# EasyEDA Pro project little_squeaky_machine.eprj, board Little Squeaky Machine
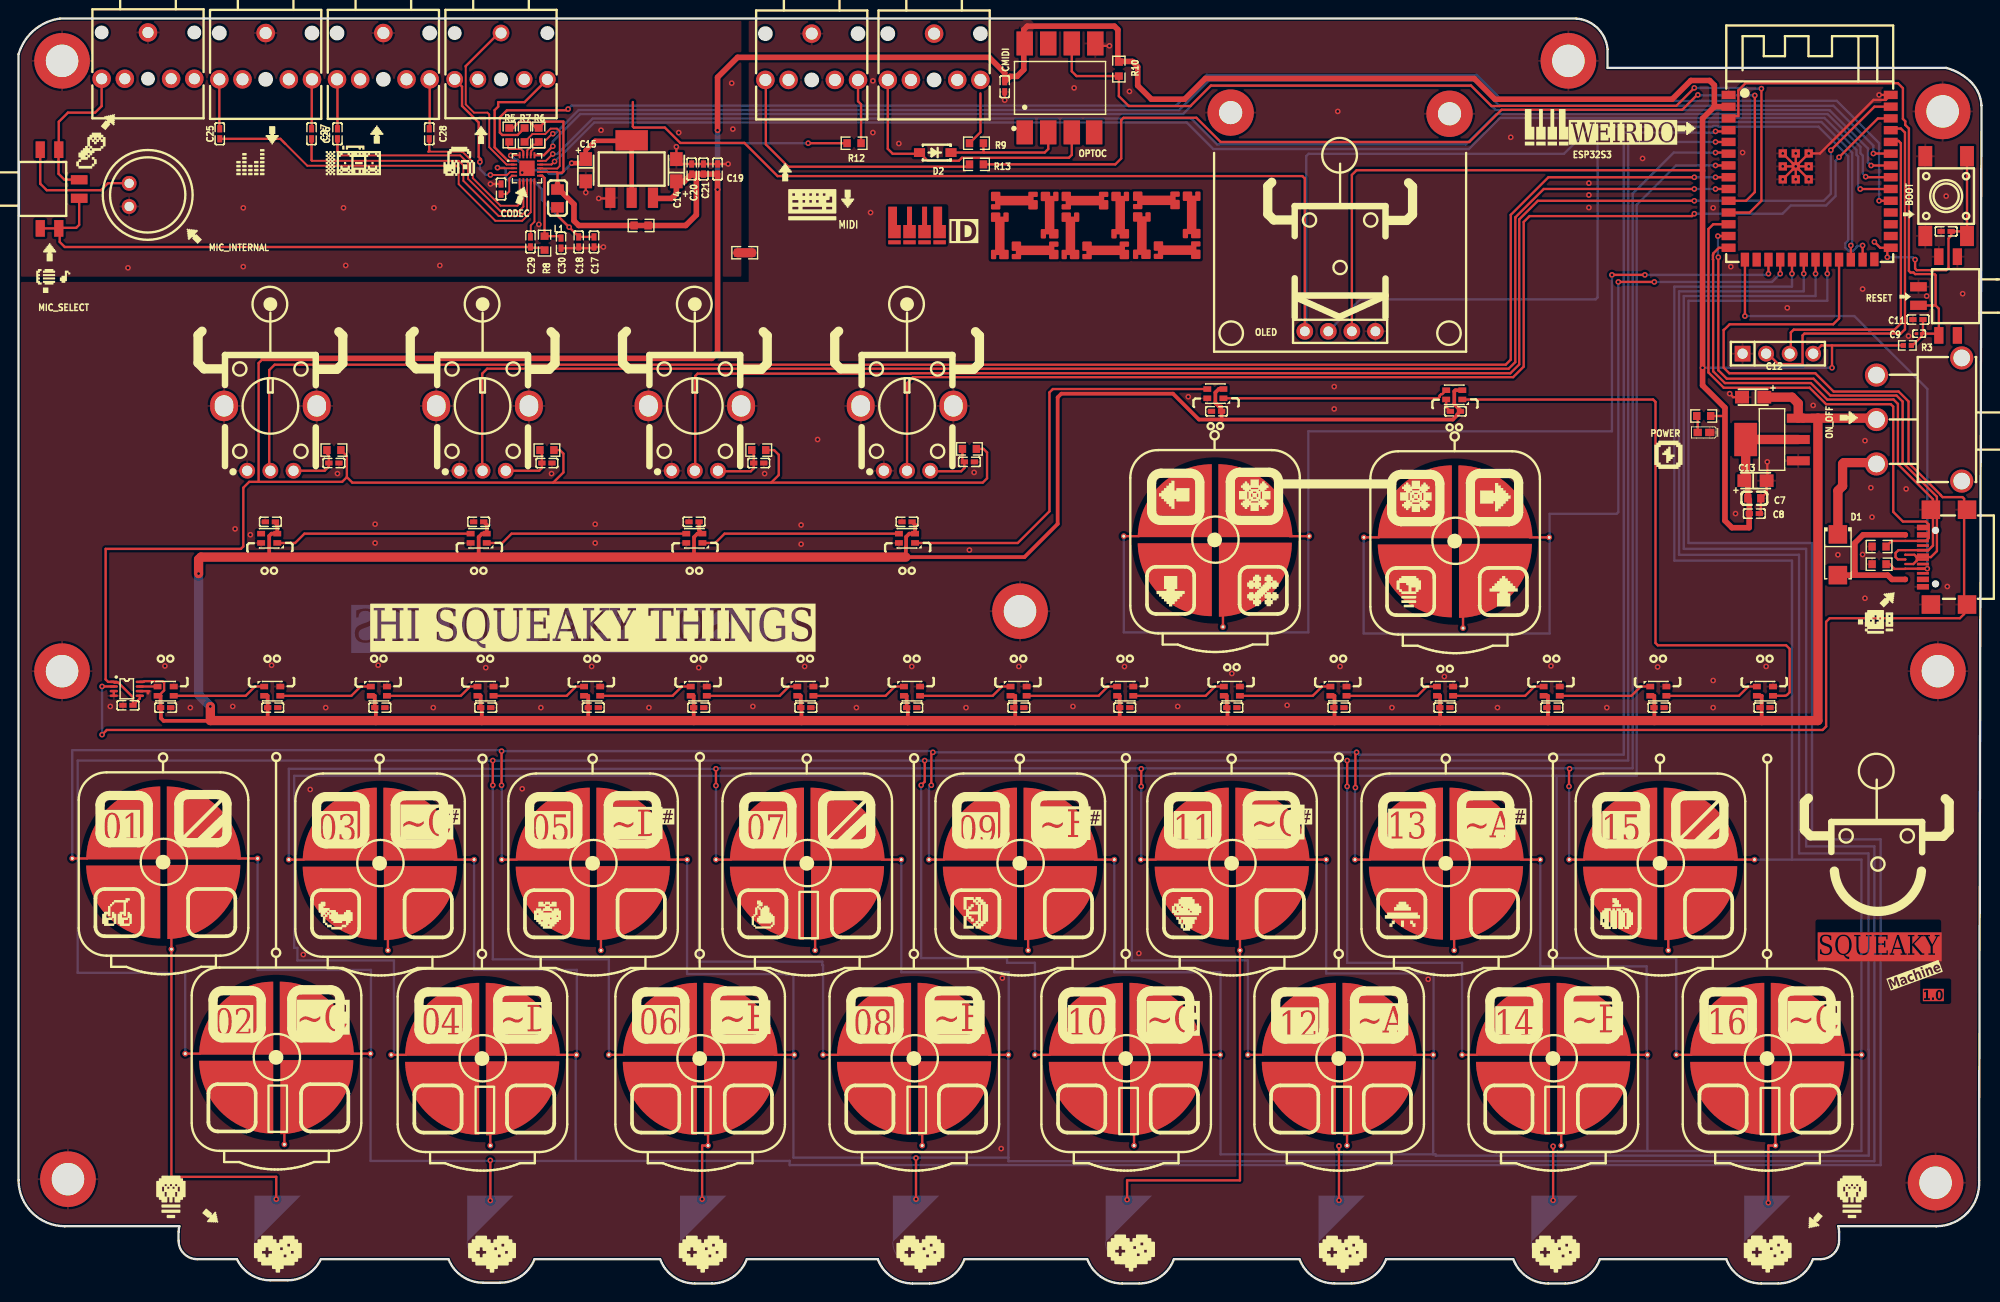
[diagram p4: board, top side]
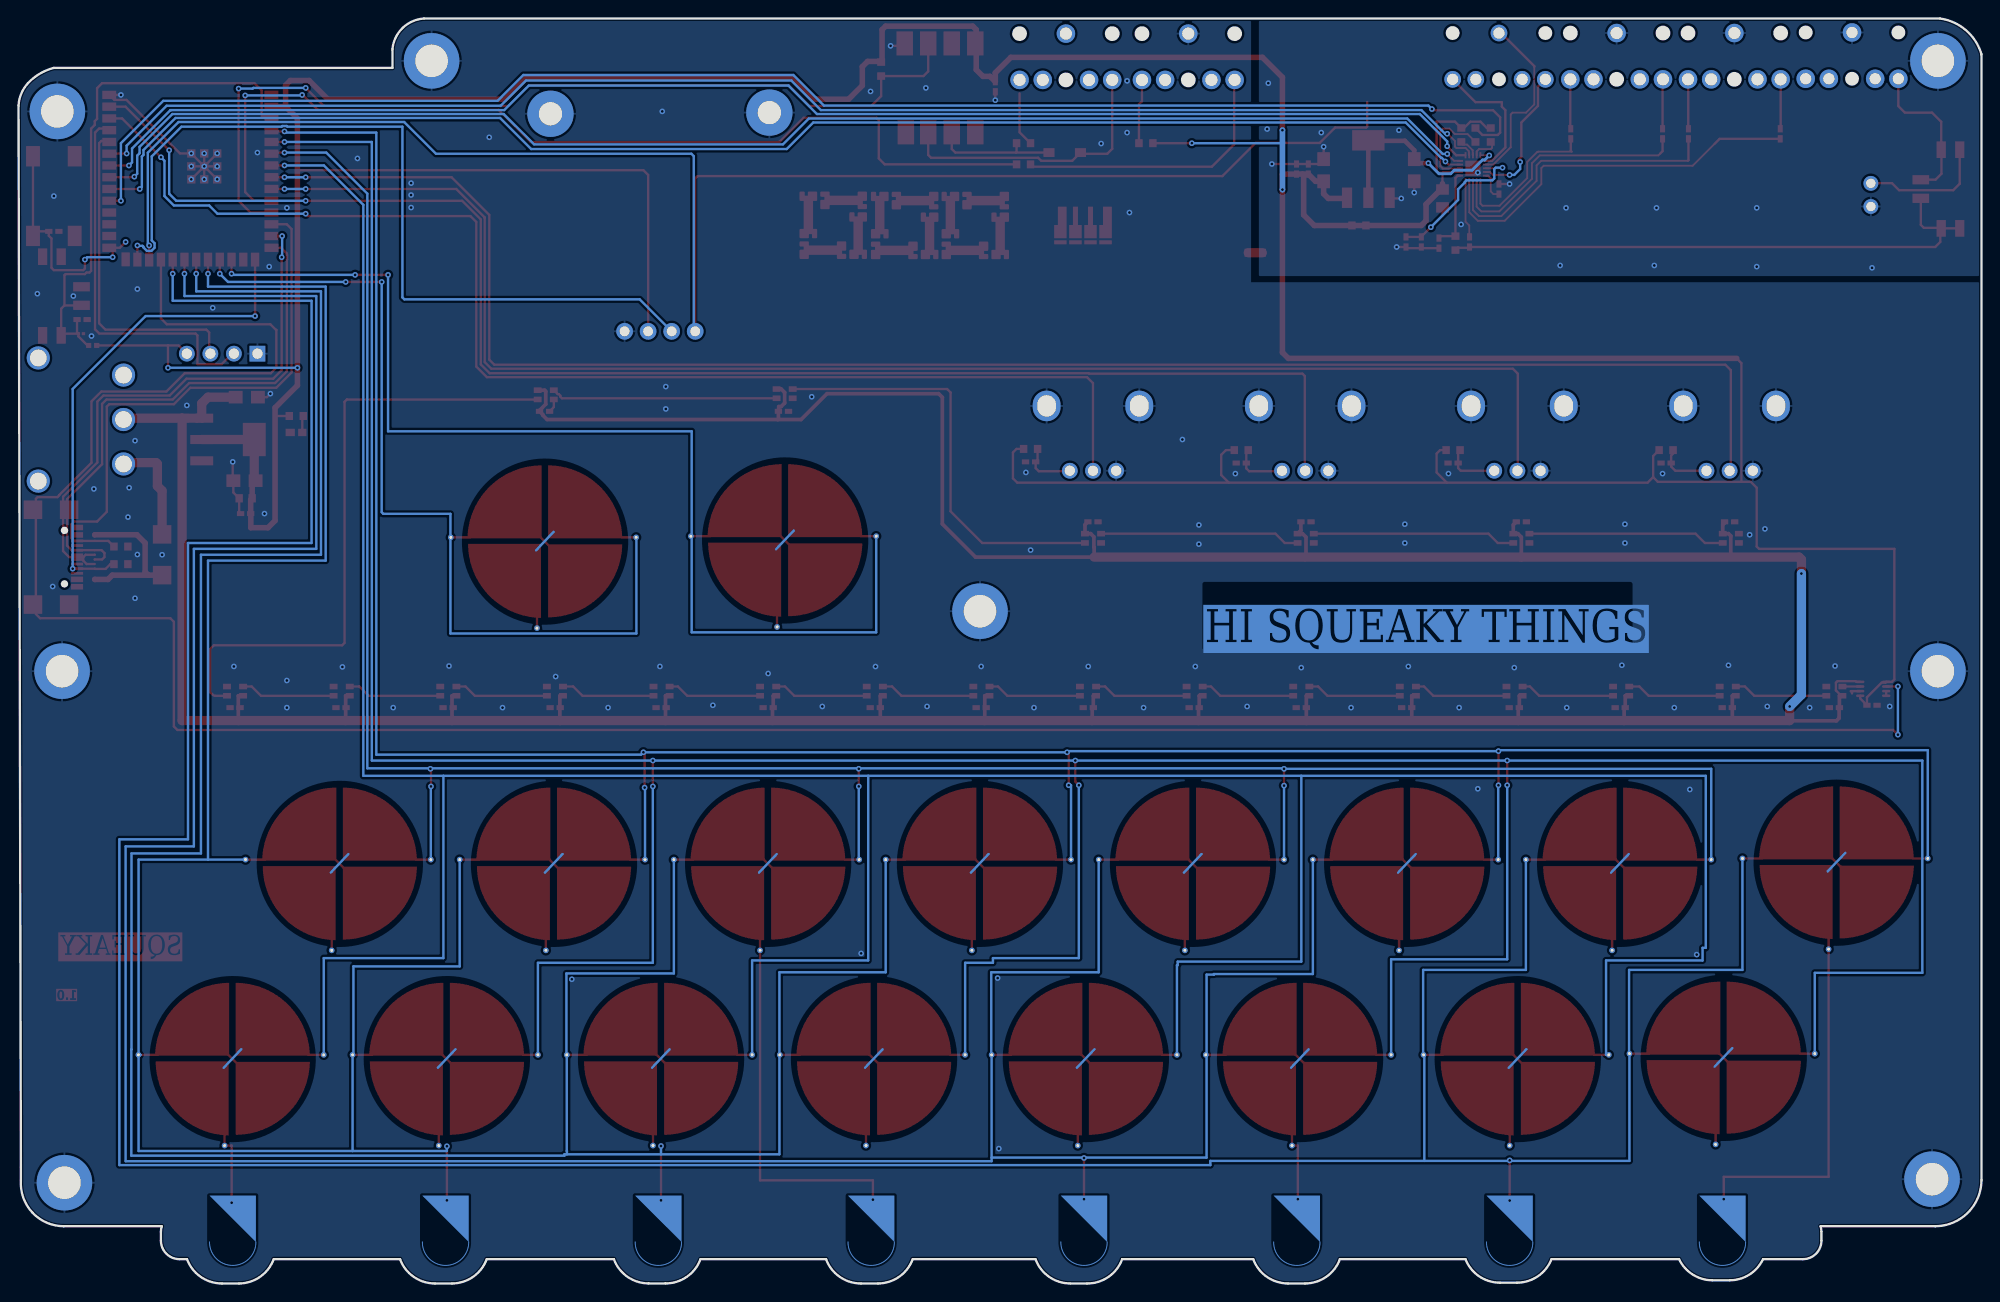
[diagram p5: board, bottom side, seen from below]

Outline 211.84 x 136.61 mm; copper layers: Top Layer, Bottom Layer. Coordinates in mm from the lower left corner of the outline.
Outline path: 0,132.74 arc(1.67,135.34) 4.48,136.61 168.08,136.61 arc(170.39,135.58) 171.48,133.3 171.48,131.28 208.04,131.28 arc(209.54,130.65) 210.82,129.63 arc(211.54,128.51) 211.84,127.21 211.58,12.56 211.58,11.14 arc(211.32,9.27) 210.34,7.66 arc(208.81,6.57) 206.96,6.18 196.38,6.18 arc(196.45,5.89) 196.47,5.58 196.47,4.63 arc(195.88,3.21) 194.47,2.63 193.65,2.63 arc(192.19,0.72) 189.89,0 188.06,0 arc(185.77,0.72) 184.3,2.63 170.66,2.63 arc(169.2,0.72) 166.91,0 165.07,0 arc(162.78,0.72) 161.31,2.63 147.59,2.63 arc(146.12,0.73) 143.83,0.01 142,0.01 arc(139.71,0.73) 138.24,2.63 124.69,2.63 arc(123.22,0.72) 120.93,0 119.1,0 arc(116.81,0.72) 115.34,2.63 102.08,2.63 arc(100.62,0.72) 98.33,0 96.49,0 arc(94.2,0.72) 92.73,2.63 78.59,2.63 arc(77.12,0.72) 74.83,0 73,0 arc(70.7,0.72) 69.24,2.63 55.69,2.63 arc(54.22,0.78) 51.96,0.08 50.13,0.08 arc(47.87,0.78) 46.4,2.63 32.63,2.63 arc(31.16,0.96) 29.02,0.34 27.19,0.34 arc(25.05,0.96) 23.57,2.63 19.27,2.63 arc(17.86,3.21) 17.27,4.63 17.27,5.58 arc(17.3,5.89) 17.36,6.18 5,6.18 arc(1.46,7.65) 0,11.18 0,132.74
Stack: Top Layer 0.035mm / Dielectric1 1.51mm FR4 er 4.5 / Bottom Layer 0.035mm

## Design rules (mm)
template: Custom Config
spacing copperThickness1oz (default): track to track 0.17, other pairs 0.152 to 0.3
spacing copperThickness2oz: track to track 0.203, other pairs 0.152 to 0.3
track width copperThickness1oz (default): min 0.127, default 0.254, max 2.54
track width copperThickness2oz: min 0.203, default 0.254, max 2.54
differential pair differentialPair (default): width min 0.127, default 0.254, max 2.54; gap min 0.152, default 0.152
via viaSize (default): diameter min 0.5, default 0.61, max 10; hole min 0.3, default 0.305, max 6.3

## Placement (name value [footprint] x y rotation side)
3_3_BRIGDE  0  [R0603]  67.18 114.26 0 top
A_D_BRIDGE  0  [R0603]  78.37 111.32 0 top
BOOT  TS-1102S-C-C-B  [KEY-SMD_4P-L6.0-W6.0-P4.50-LS8.6]  208.03 117.44 270 top
C7  10uF  [C0603]  187.32 84.8 0 top
C8  100nF  [C0402]  187.32 83.15 180 top
C9  1uF  [C0201]  205.1 102.58 180 top
C10  100nF  [C0402]  208.03 113.63 0 top
C11  100nF  [C0402]  204.98 104.1 0 top
C12  10uF  [CASE-A_3216]  187.2 95.72 180 top
C13  22uF  [CASE-A_3216]  187.45 86.7 0 top
C14  10uF  [CASE-A_3216]  70.99 120.23 90 top
C15  22uF  [CASE-A_3216]  61.21 120.23 270 top
C16  100nF  [C0402]  11.81 62.44 0 top
C17  100nF  [C0402]  62.1 112.48 90 top
C18  2.2uF  [C0402]  60.45 112.48 90 top
C19  2.2uF  [C0402]  75.44 120.36 270 top
C20  100nF  [C0402]  72.64 120.36 270 top
C21  100nF  [C0402]  73.91 120.36 270 top
C22  150nF  [C0402]  52.07 118.2 270 top
C25  2.2uF  [C0402]  21.72 124.16 270 top
C26  2.2uF  [C0402]  31.62 124.16 270 top
C27  2.2uF  [C0402]  34.42 124.16 270 top
C28  2.2uF  [C0402]  44.32 124.16 270 top
C29  100nF  [C0402]  55.24 112.48 90 top
C30  2.2uF  [C0402]  58.55 112.36 90 top
C31  22uF  [C0402]  102.62 88.73 180 top
C32  22uF  [C0402]  79.88 88.61 180 top
C33  22uF  [C0402]  57.02 88.61 180 top
C34  22uF  [C0402]  34.04 88.61 180 top
CLED1  100nF  [C0402]  15.88 62.19 180 top
CLED2  100nF  [C0402]  27.43 62.19 180 top
CLED3  100nF  [C0402]  38.99 62.19 180 top
CLED4  100nF  [C0402]  50.42 62.19 180 top
CLED5  100nF  [C0402]  62.03 62.19 180 top
CLED6  100nF  [C0402]  73.41 62.19 180 top
CLED7  100nF  [C0402]  84.96 62.19 180 top
CLED8  100nF  [C0402]  96.39 62.19 180 top
CLED9  100nF  [C0402]  107.95 62.19 180 top
CLED10  100nF  [C0402]  119.38 62.19 180 top
CLED11  100nF  [C0402]  130.94 62.19 180 top
CLED12  100nF  [C0402]  142.49 62.19 180 top
CLED13  100nF  [C0402]  153.92 62.19 180 top
CLED14  100nF  [C0402]  165.48 62.19 180 top
CLED15  100nF  [C0402]  177.04 62.19 180 top
CLED16  100nF  [C0402]  188.47 62.19 180 top
CLED17  100nF  [C0402]  155.07 94.19 0 top
CLED18  100nF  [C0402]  129.29 94.19 0 top
CLED19  100nF  [C0402]  95.88 82.26 0 top
CLED20  100nF  [C0402]  72.9 82.26 0 top
CLED21  100nF  [C0402]  49.66 82.26 0 top
CLED22  100nF  [C0402]  27.18 82.26 0 top
CMIDI  100nF  [C0402]  106.43 129.25 90 top
CODEC  SGTL5000XNLA3R2  [QFN-20_L3.0-W3.0-P0.40-BL-EP1.7]  54.88 120.44 270 top
D1  SS34  [SMA_L4.3-W2.6-LS5.2-RD]  196.34 78.7 270 top
D2  1N914W  [SOD-123_L2.7-W1.6-LS3.7-RD-1]  98.93 122.13 180 top
ESP32S3  ESP32-S3-WROOM-1-N16R8  [WIRELM-SMD_ESP32-S3-WROOM-1]  193.29 119.47 0 top
H_FIRMWARE  PZ254V-11-04P  [HDR-TH_4P-P2.54-V-M]  189.86 100.42 0 top
HEADPHONE  PJ-3062-HD-G  [AUDIO-TH_PJ-3062-HD-G]  52.07 132.55 270 top
L1  HCB2012KV-601T20  [L0805]  58.17 117.18 270 top
LDO  AMS1117-3.3  [SOT-223-4_L6.5-W3.5-P2.30-LS7.0-BR]  189.23 91.15 0 top
LED1  XL-2121RGBC-WS2812B  [LED-SMD_4P-L2.1-W2.1-BL]  15.88 63.97 180 top
LED2  XL-2121RGBC-WS2812B  [LED-SMD_4P-L2.1-W2.1-BL]  27.38 63.97 180 top
LED3  XL-2121RGBC-WS2812B  [LED-SMD_4P-L2.1-W2.1-BL]  38.89 63.97 180 top
LED4  XL-2121RGBC-WS2812B  [LED-SMD_4P-L2.1-W2.1-BL]  50.39 63.97 180 top
LED5  XL-2121RGBC-WS2812B  [LED-SMD_4P-L2.1-W2.1-BL]  61.9 63.97 180 top
LED6  XL-2121RGBC-WS2812B  [LED-SMD_4P-L2.1-W2.1-BL]  73.41 63.97 180 top
LED7  XL-2121RGBC-WS2812B  [LED-SMD_4P-L2.1-W2.1-BL]  84.91 63.97 180 top
LED8  XL-2121RGBC-WS2812B  [LED-SMD_4P-L2.1-W2.1-BL]  96.42 63.97 180 top
LED9  XL-2121RGBC-WS2812B  [LED-SMD_4P-L2.1-W2.1-BL]  107.92 63.97 180 top
LED10  XL-2121RGBC-WS2812B  [LED-SMD_4P-L2.1-W2.1-BL]  119.43 63.97 180 top
LED11  XL-2121RGBC-WS2812B  [LED-SMD_4P-L2.1-W2.1-BL]  130.94 63.97 180 top
LED12  XL-2121RGBC-WS2812B  [LED-SMD_4P-L2.1-W2.1-BL]  142.44 63.97 180 top
LED13  XL-2121RGBC-WS2812B  [LED-SMD_4P-L2.1-W2.1-BL]  153.95 63.97 180 top
LED14  XL-2121RGBC-WS2812B  [LED-SMD_4P-L2.1-W2.1-BL]  165.46 63.97 180 top
LED15  XL-2121RGBC-WS2812B  [LED-SMD_4P-L2.1-W2.1-BL]  176.96 63.97 180 top
LED16  XL-2121RGBC-WS2812B  [LED-SMD_4P-L2.1-W2.1-BL]  188.47 63.97 180 top
LED17  XL-2121RGBC-WS2812B  [LED-SMD_4P-L2.1-W2.1-BL]  154.94 95.97 0 top
LED18  XL-2121RGBC-WS2812B  [LED-SMD_4P-L2.1-W2.1-BL]  129.16 96.1 0 top
LED19  XL-2121RGBC-WS2812B  [LED-SMD_4P-L2.1-W2.1-BL]  95.88 80.48 0 top
LED20  XL-2121RGBC-WS2812B  [LED-SMD_4P-L2.1-W2.1-BL]  72.93 80.48 0 top
LED21  XL-2121RGBC-WS2812B  [LED-SMD_4P-L2.1-W2.1-BL]  49.66 80.48 0 top
LED22  XL-2121RGBC-WS2812B  [LED-SMD_4P-L2.1-W2.1-BL]  27.05 80.48 0 top
LINE-IN  PJ-3062-HD-B  [AUDIO-TH_PJ-3062-HD-B]  26.67 132.55 270 top
LINE-OUT  PJ-3062-HD-B  [AUDIO-TH_PJ-3062-HD-B]  39.37 132.55 270 top
MIC  PJ-3062-HD-R  [AUDIO-TH_XKB_PJ-3062-HD-R]  13.97 132.61 270 top
MIC_INTERNAL  KEAG4544PF-K  [MIC-TH_BD9.7-P2.50-D0.8-L-FD]  11.94 117.56 270 top
MIC_SELECT  XKB5858-Z-F-75  [SW-SMD_XKB5858-Z-F-75]  4.45 118.2 90 top
MIDI-IN  PJ-3062-HD-B  [AUDIO-TH_PJ-3062-HD-B]  98.81 132.48 270 top
MIDI-OUT  PJ-3062-HD-B  [AUDIO-TH_PJ-3062-HD-B]  85.6 132.48 270 top
NOREF  -  [Pad_e4938]  4.7 132.04 0 top
NOREF#2  -  [Pad_e1853]  207.64 126.58 0 top
NOREF#3  -  [Pad_e1862]  207.14 66.13 0 top
NOREF#4  -  [Pad_e1852]  167.26 132.04 0 top
NOREF#5  -  [Pad_e1861]  4.7 66.13 0 top
NOREF#6  -  [Pad_e1855]  5.33 11.26 0 top
NOREF#7  -  [Pad_e2353]  108.08 72.6 0 top
NOREF#8  -  [Pad_e4084]  154.43 126.33 0 top
NOREF#9  -  [Pad_e4082]  130.81 126.45 0 top
NOREF#10  -  [Pad_e1854]  206.88 10.88 0 top
OLED  HS96L03W2C03  [OLED-TH_L27.8-W27.2-P2.54_C9900033791]  142.62 102.83 180 top
ON_OFF  SS-12D11L7  [SW-TH_XKB_SS-12D11L7]  205.1 93.31 90 top
OPTOC  6N137S1(TA)  [SMD-8_L9.8-W6.6-P2.54-LS10.3-BL]  112.39 129.12 0 top
POT_1  10kΩ  [RES-TH_RK09K1130AAU]  27.18 91.27 0 top
POT_2  10kΩ  [RES-TH_RK09K1130AAU]  50.08 91.27 0 top
POT_3  10kΩ  [RES-TH_RK09K1130AAU]  72.98 91.27 0 top
POT_4  10kΩ  [RES-TH_RK09K1130AAU]  95.88 91.27 0 top
POWER  LED-RED  [D-L1.6-W0.8-RD]  181.86 91.91 180 top
R1  5.1kΩ  [R0603]  200.79 79.59 0 top
R2  5.1kΩ  [R0603]  200.79 77.68 0 top
R3  10kΩ  [R0402]  203.83 101.31 0 top
R4  1kΩ  [R0603]  181.86 93.69 180 top
R5  2.2kΩ  [R0603]  52.96 124.04 270 top
R6  2.2kΩ  [R0603]  56.13 124.04 270 top
R7  100Ω  [R0603]  54.61 124.04 270 top
R8  2.2kΩ  [R0603]  56.77 112.36 90 top
R9  220Ω  [R0603]  103.38 123.15 0 top
R10  470Ω  [R0603]  118.75 131.15 90 top
R12  33Ω  [R0603]  90.17 123.15 180 top
R13  10Ω  [R0603]  103.38 120.86 0 top
R14  100Ω  [R0603]  102.62 90.13 0 top
R15  100Ω  [R0603]  79.88 90 0 top
R16  100Ω  [R0603]  57.02 90 0 top
R17  100Ω  [R0603]  34.04 90 0 top
RESET  XKB5858-W-F-75  [SW-SMD_XKB5858-W-F-75]  207.14 106.64 270 top
TOUCHPAD_1  -  [matrix_touchpad]  15.3 45.8 0 top
TOUCHPAD_2  -  [matrix_touchpad]  27.49 24.72 0 top
TOUCHPAD_3  -  [matrix_touchpad]  38.66 45.68 0 top
TOUCHPAD_4  -  [matrix_touchpad]  49.71 24.59 0 top
TOUCHPAD_5  -  [matrix_touchpad]  61.65 45.68 0 top
TOUCHPAD_6  -  [matrix_touchpad]  73.21 24.59 0 top
TOUCHPAD_7  -  [matrix_touchpad]  84.77 45.68 0 top
TOUCHPAD_8  -  [matrix_touchpad]  96.32 24.59 0 top
TOUCHPAD_9  -  [matrix_touchpad]  107.75 45.68 0 top
TOUCHPAD_10  -  [matrix_touchpad]  119.18 24.59 0 top
TOUCHPAD_11  -  [matrix_touchpad]  130.61 45.68 0 top
TOUCHPAD_12  -  [matrix_touchpad]  142.17 24.59 0 top
TOUCHPAD_13  -  [matrix_touchpad]  153.73 45.68 0 top
TOUCHPAD_14  -  [matrix_touchpad]  165.28 24.59 0 top
TOUCHPAD_15  -  [matrix_touchpad]  176.84 45.68 0 top
TOUCHPAD_16  -  [matrix_touchpad]  188.4 24.59 0 top
TOUCHPAD_MAIN1  -  [matrix_touchpad]  128.78 80.61 0 top
TOUCHPAD_MAIN2  -  [matrix_touchpad]  154.69 80.48 0 top
TPA1  -  [touchpad_external]  188.72 4.45 0 top
TPA2  -  [touchpad_external]  73.89 4.45 0 top
TPA3  -  [touchpad_external]  119.82 4.45 0 top
TPA4  -  [touchpad_external]  27.95 4.45 0 top
TPA5  -  [touchpad_external]  50.92 4.45 0 top
TPA6  -  [touchpad_external]  96.85 4.45 0 top
TPA7  -  [touchpad_external]  142.79 4.45 0 top
TPA8  -  [touchpad_external]  165.76 4.45 0 top
U1  AMS1117-1.8  [SOT-223_L6.7-W3.5-P2.30-BR]  66.17 120.36 270 top
U2  GT74LVC2T45V8  [VSSOP-8_L2.3-W2.0-P0.50-LS3.1-BL]  11.68 64.22 270 top
USB  TYPEC-304YSSW-ACP16  [USB-SMD_TYPEC-304YSSW-ACP16]  207.9 78.44 90 top

## Footprints (pads in the part's own frame, mm; a bottom-side part is the same pattern mirrored in y, then rotated)
AUDIO-TH_PJ-3062-HD-B
  round 2 hole 1.3: 1(-2.5,0) 2(2.5,5) 3(2.5,2.499) 4(2.5,-2.5) 5(2.5,-5)
AUDIO-TH_PJ-3062-HD-G
  round 1.8 hole 1.2: 1(-2.5,0) 2(2.5,5) 3(2.5,2.5) 4(2.5,-2.5) 5(2.5,-5)
AUDIO-TH_XKB_PJ-3062-HD-R
  round 2 hole 1.2: 1(-2.5,0) 2(2.5,5) 3(2.5,2.5) 4(2.5,-2.5) 5(2.5,-5)
C0201
  rect 0.368x0.324 smd: 1(-0.275,0) 2(0.275,0)
C0402
  rect 0.79x0.54 smd: 1(-0.545,0) 2(0.545,0)
C0603
  rect 0.8x0.9 smd: 1(-0.7,0) 2(0.7,0)
CASE-A_3216
  rect 1.5x1.359 smd: 1(-1.2,0) 2(1.2,0)
D-L1.6-W0.8-RD
  rect 1x0.8 smd: 1(-0.65,0)
  rect 0.9x0.8 smd: 2(0.65,0)
HDR-TH_4P-P2.54-V-M
  rect 1.7x1.7 hole 1.1: 1(-3.81,0)
  round 1.7 hole 1.1: 2(-1.27,0) 3(1.27,0) 4(3.81,0)
KEY-SMD_4P-L6.0-W6.0-P4.50-LS8.6
  rect 2.2x1.5 smd: 1(-4.3,2.25) 2(4.3,2.25) 3(-4.3,-2.25) 4(4.3,-2.25)
L0805
  rect 1.133x1.377 smd: 1(-0.966,0) 2(0.966,0)
LED-SMD_4P-L2.1-W2.1-BL
  rect 0.85x0.6 smd: 1(-0.87,-0.5) 2(0.87,-0.5) 3(0.87,0.5) 4(-0.87,0.5)
matrix_touchpad
  round 0.61 hole 0.305: 1(-9.5,0.1) 2(10.5,0.1) 3(1.2,-9.7)
MIC-TH_BD9.7-P2.50-D0.8-L-FD
  round 1.6 hole 1: 1(-1.25,0) 2(1.25,0)
OLED-TH_L27.8-W27.2-P2.54_C9900033791
  round 1.8 hole 1.05: 1(-3.81,0) 2(-1.27,0) 3(1.27,0) 4(3.81,0)
Pad_e1852
  round 6 hole 3.5: (0,0)
Pad_e1853
  round 6 hole 3.5: (0,0)
Pad_e1854
  round 6 hole 3.5: (0,0)
Pad_e1855
  round 6 hole 3.5: (0,0)
Pad_e1861
  round 6 hole 3.5: (0,0)
Pad_e1862
  round 6 hole 3.5: (0,0)
Pad_e2353
  round 6 hole 3.5: (0,0)
Pad_e4082
  round 5 hole 2.5: (0,0)
Pad_e4084
  round 5 hole 2.5: (0,0)
Pad_e4938
  round 6 hole 3.5: (0,0)
QFN-20_L3.0-W3.0-P0.40-BL-EP1.7
  rect 0.2x0.665 smd: 1(-0.8,-1.407) 2(-0.4,-1.407) 3(0,-1.407) 4(0.4,-1.407) 5(0.8,-1.407) 11(0.8,1.407) 12(0.4,1.407) 13(0,1.407) 14(-0.4,1.407) 15(-0.8,1.407)
  rect 0.665x0.2 smd: 6(1.407,-0.8) 7(1.407,-0.4) 8(1.407,0) 9(1.407,0.4) 10(1.407,0.8) 16(-1.407,0.8) 17(-1.407,0.4) 18(-1.407,0) 19(-1.407,-0.4) 20(-1.407,-0.8)
  rect 1.65x1.65 smd: 21(0,0)
R0402
  rect 0.566x0.54 smd: 1(-0.433,0) 2(0.433,0)
R0603
  rect 0.806x0.864 smd: 1(-0.753,0) 2(0.753,0)
RES-TH_RK09K1130AAU
  round 1.7 hole 1.1: 1(-2.5,-3.5) 2(0,-3.5) 3(2.5,-3.5)
  oval 3x3.3 hole 2x2.3: 4(5,3.5) 5(-5,3.5)
SMA_L4.3-W2.6-LS5.2-RD
  rect 2x2 smd: 1(-2.2,0) 2(2.2,0)
SMD-8_L9.8-W6.6-P2.54-LS10.3-BL
  rect 1.78x2.6 smd: 1(-3.81,-4.8) 2(-1.27,-4.8) 3(1.27,-4.8) 4(3.683,-4.8) 5(3.81,4.8) 6(1.27,4.8) 7(-1.27,4.8) 8(-3.81,4.8)
SOD-123_L2.7-W1.6-LS3.7-RD-1
  rect 1.2x0.95 smd: 1(-1.7,0) 2(1.7,0)
SOT-223-4_L6.5-W3.5-P2.30-LS7.0-BR
  rect 2.47x0.98 smd: 1(2.835,-2.3) 2(2.835,0) 3(2.835,2.3)
  rect 2.47x3.6 smd: 4(-2.835,0)
SOT-223_L6.7-W3.5-P2.30-BR
  rect 2.2x1.1 smd: 1(3.099,-2.3) 2(3.099,0) 3(3.099,2.3)
  rect 2.2x3.5 smd: 4(-3.099,0)
SW-SMD_XKB5858-W-F-75
  rect 1.8x1 smd: 1(-4.25,2.1) 2(-4.25,0.1) 3(4.25,2.1) 4(4.25,0.1)
  rect 1x1.8 smd: 5(-1,-2.1) 6(1,-2.1)
SW-SMD_XKB5858-Z-F-75
  rect 1.8x1 smd: 1(-4.25,2.1) 2(-4.25,0.1) 3(4.25,2.1) 4(4.25,0.1)
  rect 1x1.8 smd: 5(-1,-2.1) 6(1,-2.1)
SW-TH_XKB_SS-12D11L7
  round 2.5 hole 1.8: 1(-4.8,4.6) 2(0,4.6) 3(4.8,4.6) 4(6.65,-4.6) 5(-6.65,-4.6)
touchpad_external
  custom 5x7.54 smd far side: 1(0,1.27)
USB-SMD_TYPEC-304YSSW-ACP16
  rect 2x2 smd: 13(-5.12,1.52) 14(5.12,1.52) 15(-5.12,-2.38) 16(5.12,-2.38)
  rect 0.6x1.3 smd: A1B12(-3.2,2.38) A4B9(-2.4,2.38) B1A12(3.2,2.38) B4A9(2.4,2.38)
  rect 0.3x1.3 smd: A5(-1.25,2.38) A6(-0.25,2.38) A7(0.25,2.38) A8(1.25,2.38) B5(1.75,2.38) B6(0.75,2.38) B7(-0.75,2.38) B8(-1.75,2.38)
VSSOP-8_L2.3-W2.0-P0.50-LS3.1-BL
  oval 0.28x0.905 smd: 1(-0.75,-1.403) 2(-0.25,-1.403) 3(0.25,-1.403) 4(0.75,-1.403) 5(0.75,1.403) 6(0.25,1.403) 7(-0.25,1.403) 8(-0.75,1.403)
WIRELM-SMD_ESP32-S3-WROOM-1
  rect 1.5x0.9 smd: 1(-8.75,8.895) 2(-8.75,7.625) 3(-8.75,6.355) 4(-8.75,5.085) 5(-8.75,3.815) 6(-8.75,2.545) 7(-8.75,1.275) 8(-8.75,0.005) 9(-8.75,-1.265) 10(-8.75,-2.535) 11(-8.75,-3.805) 12(-8.75,-5.075) 13(-8.75,-6.345) 14(-8.75,-7.615) 27(8.75,-7.615) 28(8.75,-6.345) 29(8.75,-5.075) 30(8.75,-3.805) 31(8.75,-2.535) 32(8.75,-1.265) 33(8.75,0.005) 34(8.75,1.275) 35(8.75,2.545) 36(8.75,3.815) 37(8.75,5.085) 38(8.75,6.355) 39(8.75,7.625) 40(8.75,8.895)
  rect 0.9x1.5 smd: 15(-6.985,-8.895) 16(-5.715,-8.895) 17(-4.445,-8.895) 18(-3.175,-8.895) 19(-1.905,-8.895) 20(-0.635,-8.895) 21(0.635,-8.895) 22(1.905,-8.895) 23(3.175,-8.895) 24(4.445,-8.895) 25(5.715,-8.895) 26(6.985,-8.865)
  rect 0.9x0.9 smd: 41(-2.9,2.575) 41(-2.9,1.175) 41(-2.9,-0.225) 41(-1.5,2.575) 41(-1.5,1.175) 41(-1.5,-0.225) 41(-0.1,2.575) 41(-0.1,1.175) 41(-0.1,-0.225)

## Nets
+1.8V: C15.1 CODEC.20 U1.2 U1.4
+3.3V: 3_3_BRIGDE.1 3_3_BRIGDE.2 C7.1 C8.2 C13.1 C14.1 C16.2 C19.2 C20.2 C21.2 CMIDI.2 CODEC.12 ESP32S3.2 H_FIRMWARE.4 L1.1 LDO.2 LDO.4 OLED.2 OPTOC.8 R3.1 R4.1 R5.1 R6.1 R10.2 R12.2 R14.2 R15.2 R16.2 R17.2 U1.3 U2.1 U2.5
+5V: C12.1 CLED1.2 CLED2.2 CLED3.2 CLED4.2 CLED5.2 CLED6.2 CLED7.2 CLED8.2 CLED9.2 CLED10.2 CLED11.2 CLED12.2 CLED13.2 CLED14.2 CLED15.2 CLED16.2 CLED17.2 CLED18.2 CLED19.2 CLED20.2 CLED21.2 CLED22.2 LDO.3 LED1.3 LED2.3 LED3.3 LED4.3 LED5.3 LED6.3 LED7.3 LED8.3 LED9.3 LED10.3 LED11.3 LED12.3 LED13.3 LED14.3 LED15.3 LED16.3 LED17.3 LED18.3 LED19.3 LED20.3 LED21.3 LED22.3 ON_OFF.2 U2.8
AGND: A_D_BRIDGE.1 A_D_BRIDGE.2 BOOT.3 BOOT.4 C7.2 C8.1 C9.2 C10.1 C11.1 C12.2 C13.2 C14.2 C15.2 C16.1 C17.1 C18.1 C19.1 C20.1 C21.1 C22.1 C30.1 C31.1 C32.1 C33.1 C34.1 CLED1.1 CLED2.1 CLED3.1 CLED4.1 CLED5.1 CLED6.1 CLED7.1 CLED8.1 CLED9.1 CLED10.1 CLED11.1 CLED12.1 CLED13.1 CLED14.1 CLED15.1 CLED16.1 CLED17.1 CLED18.1 CLED19.1 CLED20.1 CLED21.1 CLED22.1 CMIDI.1 CODEC.21 ESP32S3.1 ESP32S3.40 ESP32S3.41 H_FIRMWARE.1 LDO.1 LED1.1 LED2.1 LED3.1 LED4.1 LED5.1 LED6.1 LED7.1 LED8.1 LED9.1 LED10.1 LED11.1 LED12.1 LED13.1 LED14.1 LED15.1 LED16.1 LED17.1 LED18.1 LED19.1 LED20.1 LED21.1 LED22.1 LINE-IN.1 LINE-OUT.1 MIC.1 MIC_INTERNAL.2 MIDI-OUT.1 NOREF. NOREF#2. NOREF#3. NOREF#4. NOREF#5. NOREF#6. NOREF#7. NOREF#8. NOREF#9. NOREF#10. OLED.1 OPTOC.5 POT_1.1 POT_1.4 POT_1.5 POT_2.1 POT_2.4 POT_2.5 POT_3.1 POT_3.4 POT_3.5 POT_4.1 POT_4.4 POT_4.5 POWER.1 R1.1 R2.1 RESET.1 RESET.2 RESET.5 U1.1 U2.3 U2.4 U2.6 USB.13 USB.14 USB.15 USB.16 USB.A1B12 USB.B1A12
VBUS: D1.2 USB.A4B9 USB.B4A9
CHIP_BOOT: BOOT.1 BOOT.2 C10.2 ESP32S3.27
CHIP_RESET: C9.1 C11.2 ESP32S3.3 R3.2 RESET.4 RESET.6
FIRMWARE_RX: ESP32S3.36 H_FIRMWARE.3
FIRMWARE_TX: ESP32S3.37 H_FIRMWARE.2
HEADPHONE_GROUND: CODEC.2 HEADPHONE.1
HEADPHONE_LEFT: CODEC.4 HEADPHONE.5
HEADPHONE_RIGHT: CODEC.1 HEADPHONE.2
I2C_SCL: CODEC.19 ESP32S3.25 OLED.3 R5.2
I2C_SDA: CODEC.18 ESP32S3.24 OLED.4 R6.2
I2S_BCLK: CODEC.15 ESP32S3.33
I2S_DIN: CODEC.17 ESP32S3.35
I2S_DOUT: CODEC.16 ESP32S3.34
I2S_MLCK: ESP32S3.31 R7.1
I2S_WS: CODEC.14 ESP32S3.32
LED_CTRL: ESP32S3.23 U2.2
LINE_IN_LEFT: C25.1 LINE-IN.5
LINE_IN_RIGHT: C26.1 LINE-IN.2
LINE_OUT_LEFT: C27.1 LINE-OUT.5
LINE_OUT_RIGHT: C28.1 LINE-OUT.2
MIC_EXTERNAL: MIC.5 MIC_SELECT.4 MIC_SELECT.6
MIC_IN: C29.1 MIC_SELECT.1 MIC_SELECT.2 MIC_SELECT.5 R8.1
MIC_INTERNAL: MIC_INTERNAL.1 MIC_SELECT.3
MIDI_IN: ESP32S3.11 OPTOC.6 R10.1
MIDI_OUT: ESP32S3.10 R13.2
POT_1: ESP32S3.8 POT_1.2
POT_2: ESP32S3.9 POT_2.2
POT_3: ESP32S3.39 POT_3.2
POT_4: ESP32S3.38 POT_4.2
TOUCH_COL_1: ESP32S3.22 TOUCHPAD_1.2 TOUCHPAD_2.2 TOUCHPAD_3.2 TOUCHPAD_4.2 TPA5.1
TOUCH_COL_2: ESP32S3.21 TOUCHPAD_5.2 TOUCHPAD_6.2 TOUCHPAD_7.2 TOUCHPAD_8.2 TPA6.1
TOUCH_COL_3: ESP32S3.20 TOUCHPAD_9.2 TOUCHPAD_10.2 TOUCHPAD_11.2 TOUCHPAD_12.2 TPA7.1
TOUCH_COL_4: ESP32S3.19 TOUCHPAD_13.2 TOUCHPAD_14.2 TOUCHPAD_15.2 TOUCHPAD_16.2 TPA8.1
TOUCH_MAIN_1: ESP32S3.17 TOUCHPAD_MAIN1.1 TOUCHPAD_MAIN1.2
TOUCH_MAIN_2: ESP32S3.18 TOUCHPAD_MAIN2.1 TOUCHPAD_MAIN2.2
TOUCH_ROW_1: ESP32S3.4 TOUCHPAD_1.1 TOUCHPAD_5.1 TOUCHPAD_9.1 TOUCHPAD_13.1
TOUCH_ROW_2: ESP32S3.5 TOUCHPAD_2.1 TOUCHPAD_6.1 TOUCHPAD_10.1 TOUCHPAD_14.1
TOUCH_ROW_3: ESP32S3.6 TOUCHPAD_3.1 TOUCHPAD_7.1 TOUCHPAD_11.1 TOUCHPAD_15.1
TOUCH_ROW_4: ESP32S3.7 TOUCHPAD_4.1 TOUCHPAD_8.1 TOUCHPAD_12.1 TOUCHPAD_16.1
USB_D+: ESP32S3.14 USB.A6 USB.B6
USB_D-: ESP32S3.13 USB.A7 USB.B7
USB_POWER_MANAGEMENT: ESP32S3.12 R1.2 USB.B5
USB_POWER_MANAGEMENT2: ESP32S3.15 R2.2 USB.A5
$1N3148: POWER.2 R4.2
$1N7009: D1.1 ON_OFF.1
$2N6260: CODEC.13 R7.2
$2N10513: C17.2 C18.2 CODEC.3 L1.2
$2N11857: C22.2 CODEC.5
$2N12488: C28.2 CODEC.6
$2N12493: C27.2 CODEC.7
$2N12499: C26.2 CODEC.8
$2N12505: C25.2 CODEC.9
$2N12879: C29.2 CODEC.10
$2N12925: C30.2 CODEC.11 R8.2
$3N2922: LED1.2 U2.7
$3N5101: LED1.4 LED2.2
$3N5214: LED2.4 LED3.2
$3N5662: LED3.4 LED4.2
$3N5779: LED4.4 LED5.2
$3N6015: LED5.4 LED6.2
$3N6132: LED6.4 LED7.2
$3N7352: LED13.4 LED14.2
$3N7353: LED12.4 LED13.2
$3N7358: LED10.4 LED11.2
$3N7360: LED11.4 LED12.2
$3N7361: LED7.4 LED8.2
$3N7363: LED9.4 LED10.2
$3N7367: LED8.4 LED9.2
$3N8110: LED20.4 LED21.2
$3N8111: LED19.4 LED20.2
$3N8116: LED17.4 LED18.2
$3N8118: LED18.4 LED19.2
$3N8119: LED14.4 LED15.2
$3N8121: LED16.4 LED17.2
$3N8125: LED15.4 LED16.2
$3N8263: LED21.4 LED22.2
$4N5997: TOUCHPAD_16.3 TPA1.1
$4N6001: TOUCHPAD_11.3 TPA3.1
$4N6017: TOUCHPAD_14.3
$4N6029: TOUCHPAD_6.3 TPA2.1
$4N6031: TOUCHPAD_1.3 TPA4.1
$5N1901: C31.2 POT_4.3 R14.1
$5N2026: C32.2 POT_3.3 R15.1
$5N2131: C33.2 POT_2.3 R16.1
$5N2225: C34.2 POT_1.3 R17.1
$6N2073: D2.1 OPTOC.2 R9.2
$6N2078: D2.2 MIDI-IN.5 OPTOC.3
$6N2276: MIDI-IN.2 R9.1
$6N18274: MIDI-OUT.5 R13.1
$6N18276: MIDI-OUT.2 R12.1

Pads without a net: ESP32S3 16 26 28 29 30; HEADPHONE 3 4; LED22 4; LINE-IN 3 4; LINE-OUT 3 4; MIC 2 3 4; MIDI-IN 1 3 4; MIDI-OUT 3 4; ON_OFF 3 4 5; OPTOC 1 4 7; RESET 3; TOUCHPAD_2 3; TOUCHPAD_3 3; TOUCHPAD_4 3; TOUCHPAD_5 3; TOUCHPAD_7 3; TOUCHPAD_8 3; TOUCHPAD_9 3; TOUCHPAD_10 3; TOUCHPAD_12 3; TOUCHPAD_13 3; TOUCHPAD_15 3; TOUCHPAD_MAIN1 3; TOUCHPAD_MAIN2 3; USB A8 B8

## Via types
v1: diameter 0.61, hole 0.305, Top Layer to Bottom Layer, 212 vias

## Routing (per net, layer and track width the routed paths; a pad name or vN(x,y) marks a point on that pad's centre or on a via; arc(x,y) is an arc through that point)
+1.8V: length 23.1
  Top Layer w0.2: v1(53.12,121.82) 53.36,121.82 53.38,121.85 CODEC.20
  Top Layer w0.5: U1.2 U1.4 66.12,123.4 62.23,123.4 61.21,122.39 C15.1 60.78,120.99 v1(59.69,120.99)
  Bottom Layer w0.3: v1(53.12,121.82) 53.61,121.34 53.85,121.34 54.96,120.23 56.9,120.23 57.28,119.85 58.55,119.85 v1(59.69,120.99)
+3.3V: length 571.5
  Top Layer w0.2: CODEC.12 58.08,120.04 58.17,119.96
  Top Layer w0.254: R14.2 104.14,90.13 104.52,89.75 104.52,86.96 104.05,86.49 81.23,86.49 ; H_FIRMWARE.4 194.56,101.31 195.71,101.31 ; 81.23,86.49 82.04,87.3 82.04,89.5 81.53,90 R15.2 ; 81.23,86.49 57.7,86.49 ; v1(195.71,98.89) 195.71,101.31 ; 195.71,101.31 R3.1 ; R16.2 58.42,90 58.8,89.62 58.8,87.59 57.7,86.49 ; 25.91,86.57 25.91,99.4 26.42,99.91 ; 25.91,86.57 34.93,86.57 35.43,87.08 ; 25.91,86.57 24.89,86.57 24.26,85.94 24.26,79.59 24,79.34 9.4,79.34 9.4,65.24 9.66,64.97 U2.1 10.36,64.89 10.77,64.89 12.36,63.3 C16.2 13.09,63.18 U2.5 ; R17.2 35.43,89.36 35.43,87.08 ; 58.17,118.77 58.17,119.96 58.65,119.96 58.8,120.1 58.8,125.48 56.82,125.48 R6.1 55.84,124.79 55.16,125.47 54.06,125.47 53.38,124.79 R5.1 ; OLED.2 143.89,119.72 144.4,120.23 181.69,120.23 181.74,120.18 ; 57.7,86.49 36.03,86.49 35.43,87.08 ; R12.2 v1(85.22,123.15) ; R4.1 183.99,93.69
  Top Layer w0.6: 73.27,119.81 73.15,119.68 73.15,115.41 72,114.26 3_3_BRIGDE.2 3_3_BRIGDE.1 60.45,114.26 59.94,114.77 59.94,116.55 58.17,118.32 58.17,118.77 ; 73.27,119.81 C20.2 71.86,119.03 C14.1 70.99,117.69 70.48,117.18 68.54,117.18 U1.3 ; 73.27,119.81 C21.2 C19.2 v1(75.44,118.14) 75.44,100.54 74.8,99.91 26.42,99.91 ; 183.01,127.09 181.74,125.82 v1(181.74,98.89) 181.74,96.99 184.15,94.58 184.15,82.38 184.91,81.62 186.76,81.62 186.76,83.13 C8.2 186.78,84.64 C7.1 186.62,86.33 C13.1 ; 183.01,127.09 183.01,129.4 182.5,129.92 180.47,129.92 178.45,127.9 159.34,127.9 157.1,130.14 128.09,130.14 125.85,127.9 122.25,127.9 120.78,129.37 120.78,131.41 120.21,131.98 118.82,131.98 R10.2 118.64,132.01 118.64,135.41 118.26,135.79 108.86,135.79 108.48,135.41 108.48,131.09 107.76,130.36 107,130.36 CMIDI.2 106.43,130.74 104.75,132.42 77.59,132.42 75.44,130.26 v1(75.44,124.55) ; 183.01,127.09 ESP32S3.2
  Top Layer w1: LDO.2 LDO.4 186.39,86.84 C13.1
  Bottom Layer w0.254: 75.44,123.21 75.5,123.15 v1(85.22,123.15) ; v1(195.71,98.89) v1(181.74,98.89)
  Bottom Layer w0.6: v1(75.44,118.14) v1(75.44,124.55)
+5V: length 474.6
  Top Layer w0.254: U2.8 13.5,64.97 13.58,65.05 15.55,65.05 15.71,64.88 15.71,64.05 15.12,63.47
  Top Layer w0.3: 72.9,78.93 72.9,78.68 73.13,78.45
  Top Layer w0.4: 165.05,60.79 165.05,63.47 LED14.3 ; LED4.3 49.87,63.47 CLED4.2 49.99,62.19 49.99,60.79 ; 49.69,78.45 49.66,78.48 49.66,80.61 50.03,80.98 LED21.3 50.53,81.93 50.2,82.26 ; CLED19.2 96.75,81.94 LED19.3 96.13,80.98 95.79,80.63 95.79,79.53 95.76,79.5 95.76,78.45 108.56,78.45 112.14,82.03 112.14,95.7 112.54,96.1 124.59,96.1 127.38,93.31 129.9,93.31 ; LED18.3 130.02,96.61 129.54,96.61 129.16,96.23 129.16,95.08 129.54,94.7 129.79,94.7 129.79,94.23 CLED18.2 129.83,93.38 129.9,93.31 ; 84.04,63.47 84.42,63.47 CLED7.2 84.49,62.19 84.49,60.79 ; LED10.3 118.83,63.47 CLED10.2 118.83,61.05 ; LED1.3 15.33,63.47 CLED1.2 15.37,62.19 15.37,61.05 15.65,60.76 20.66,60.76 20.7,60.81 ; 153.42,60.79 153.42,63.47 LED13.3 ; 27.72,82.13 27.92,81.93 LED22.3 27.3,80.98 27.05,80.73 27.05,78.7 ; 142.02,60.79 142.02,63.47 LED12.3 ; 72.9,78.93 72.9,80.61 73.27,80.98 LED20.3 73.44,81.34 CLED20.2 ; 26.89,61.05 CLED2.2 26.89,63.47 LED2.3 ; 95.97,60.79 95.97,62.19 CLED8.2 95.85,63.47 LED8.3 ; 129.9,93.31 154.8,93.31 155.27,93.78 155.27,93.85 155.61,94.19 155.61,94.28 154.94,94.96 154.94,96.35 155.07,96.47 LED17.3 ; 72.86,60.79 CLED6.2 72.86,63.47 LED6.3 ; 188.12,60.79 188.12,63.47 LED16.3 ; 107.56,60.79 107.56,63.47 LED9.3 ; 176.53,60.79 176.53,63.47 LED15.3 ; 130.47,60.79 130.47,62.19 CLED11.2 130.39,63.47 LED11.3 ; 38.56,60.79 38.56,62.19 CLED3.2 38.44,63.47 LED3.3 ; 61.48,61.05 CLED5.2 61.48,63.47 LED5.3
  Top Layer w1: 72.9,78.45 19.68,78.45 19.43,78.19 v1(19.43,76.67) ; 193.47,93.45 194.18,93.45 ; 194.18,93.45 194.18,60.79 20.72,60.79 20.7,60.81 v1(20.7,62.32) ; 194.18,93.45 200.87,93.45 201.01,93.31 ; LDO.3 192.06,95.04 191.39,95.72 C12.1 ; 95.76,78.45 73.13,78.45 ; 192.58,93.45 192.57,93.45
  Bottom Layer w1: v1(20.7,62.32) 19.43,63.59 v1(19.43,76.67)
AGND: length 56
  Top Layer w0.254: v1(62.61,117.18) 63.79,117.18 U1.1 ; v1(191.79,122.04) v1(191.79,120.64) ; v1(191.79,120.64) v1(193.19,119.24) ; v1(191.79,120.64) v1(190.39,119.24) ; v1(191.79,120.64) v1(191.79,119.24) ; v1(191.79,120.64) v1(190.39,120.64) ; v1(191.79,120.64) v1(193.19,122.04) 194.41,122.04 200.19,127.82 201.5,127.82 ESP32S3.40 v1(200.79,128.36) ; v1(191.79,120.64) v1(193.19,120.64) ; v1(191.79,120.64) v1(190.39,122.04) ; C14.2 v1(70.99,122.77) ; CMIDI.1 v1(106.43,127.8) ; U2.6 14.1,63.97 13.97,63.85 13.97,63.72 ; CLED17.1 154.07,94.65 LED17.1 ; C12.2 185.04,95.72 v1(184.66,96.1) ; C15.2 v1(61.21,117.82) ; C8.1 188.02,83.3 C7.2 188.65,85.42 C13.2 188.72,86.77 v1(188.72,88.73) ; 71.24,121.18 71.52,120.9 C20.1 C21.1 C19.1 v1(76.58,120.9) ; U2.3 U2.4 ; v1(63.12,111.94) C17.1 61.98,111.81 C30.1 ; 116.2,133.66 v1(117.73,133.66) ; C22.1 v1(50.93,118.74)
  Top Layer w1: A_D_BRIDGE.1 A_D_BRIDGE.2
  vias: v1(9.91,62.32) v1(11.81,109.69) v1(15.8,66.69) v1(18.54,62.19) v1(23.11,62.32) v1(23.37,81.49) v1(24.26,116.17) v1(24.26,109.82) v1(25.02,80.86) v1(27.3,66.76) v1(30.73,35.52) v1(31.48,53.35) v1(33.15,62.19) v1(34.42,87.46) v1(35.07,116.17) v1(35.31,109.94) v1(38.48,82) v1(38.48,79.97) v1(38.81,66.77) v1(44.76,62.19) v1(44.83,116.17) v1(45.47,109.94) v1(50.42,66.51) v1(54.36,119.98) v1(54.36,53.43) v1(56.15,114.38) v1(56.37,62.19) v1(57.52,87.46) v1(61.85,66.64) v1(62.23,82) v1(62.23,79.97) v1(62.87,124.55) v1(68.03,62.19) v1(71.25,124.29) v1(73.41,66.51) v1(76.96,129.63) v1(77.09,124.67) v1(79.25,62.32) v1(80.52,87.46) v1(84.45,81.92) v1(84.45,79.84) v1(84.84,66.64) v1(86.23,91.15) v1(90.42,62.19) v1(91.95,115.66) v1(92.2,129.88) v1(92.2,124.29) v1(95,123.11) v1(96.39,66.64) v1(102.25,62.19) v1(102.62,79.21) v1(103.12,87.59) v1(106.04,14.57) v1(106.17,32.98) v1(107.95,66.64) v1(113.79,62.32) v1(113.92,129.12) v1(119.35,66.63) v1(119.89,128.74) v1(120.9,35.65) v1(125.09,62.32) v1(126.24,95.76) v1(130.94,65.87) v1(136.91,62.44) v1(141.99,96.86) v1(141.99,94.45) v1(142.37,126.58) v1(142.62,66.64) v1(148.22,62.19) v1(152.13,32.85) v1(153.87,65.55) v1(159.6,62.19) v1(161.04,123.79) v1(165.38,66.69) v1(169.47,118.83) v1(169.47,117.55) v1(169.47,116.2) v1(171.4,62.19) v1(175.26,121.5) v1(176.88,66.58) v1(182.88,116.17) v1(182.88,65.12) v1(182.88,62.19) v1(184.78,109.82) v1(185.29,83.15) v1(186.05,122.13) v1(188.59,66.64) v1(190.88,105.37) v1(193.67,94.83) v1(196.34,78.7) v1(199.01,107.4) v1(199.01,78.73) v1(199.26,91.02) v1(199.26,74) v1(199.9,85.94) v1(200.02,82.76) v1(203.71,85.81) v1(203.96,102.32) v1(205.92,106.64) v1(208.03,117.44) v1(208.15,75.27) v1(209.8,106.89)
VBUS: length 16.9
  Top Layer w0.6: 203.61,76.05 203.6,76.03 202.18,76.03 201.72,76.5 197.83,76.5 ; 197.83,76.5 198.17,76.85 198.17,79.97 199.07,80.86 203.6,80.86 203.61,80.85 ; 197.83,76.5 D1.2
(no net): length 0.1
  Top Layer w0.254: 111.12,133.66 111.06,133.6
CHIP_BOOT: length 25.4
  Top Layer w0.254: v1(201.68,110.83) 201.68,111.48 ESP32S3.27 200.91,111.85 v1(200.28,112.48) ; 210.28,113.63 C10.2 208.57,113.15 208.28,112.86 208.28,109.69 208.03,109.43 204.85,109.43 204.67,109.61 v1(204.67,110.58) ; 210.28,113.63 BOOT.2 ; 210.28,113.63 BOOT.1
  Bottom Layer w0.254: v1(201.68,110.83) 204.42,110.83 v1(204.67,110.58)
CHIP_RESET: length 59.1
  Top Layer w0.254: C11.2 205.52,102.72 C9.1 ; 204.27,101.31 204.39,101.31 205.38,102.29 C9.1 ; ESP32S3.3 184.8,126.08 185.6,126.08 185.6,128.85 186.37,129.63 202.82,129.63 203.36,129.09 203.36,125.77 203.61,125.52 203.61,125.12 204,124.72 204,109.36 204.18,109.18 204.51,109.18 204.68,109.01 206.77,109.01 206.88,108.89 206.88,105.62 ; C9.1 207.05,102.58 RESET.4 207.24,105.27 206.88,105.62 ; 206.88,105.62 205.05,105.62 RESET.6
FIRMWARE_RX: length 35.3
  Top Layer w0.254: ESP32S3.36 202.42,123.28 202.53,123.39 202.89,123.39 203.14,123.15 203.14,103.69 202.45,103.01 191.57,103.01 191.26,102.7 191.26,100.54 H_FIRMWARE.3
FIRMWARE_TX: length 41.9
  Top Layer w0.254: ESP32S3.37 202.22,124.73 203.14,124.73 203.58,124.29 203.58,103.04 203.12,102.59 192.73,102.59 192.53,102.39 192.53,99.29 189.91,99.29 188.78,100.42 H_FIRMWARE.2
HEADPHONE_GROUND: length 19.4
  Top Layer w0.2: CODEC.2 52.67,120.84 50.8,122.71 50.8,126.25 50.6,126.45 49.15,126.45 48.26,127.34 48.26,131.4
  Top Layer w0.254: HEADPHONE.1 51.83,135.05 48.26,131.47 48.26,131.4
HEADPHONE_LEFT: length 15
  Top Layer w0.2: v1(50.93,119.72) 52.72,119.72 53.04,120.04 CODEC.4
  Top Layer w0.254: HEADPHONE.5 47.86,129.25 47.86,127.17 49.66,125.38 49.66,121.66 49.91,121.41 49.91,121.25 v1(49.78,121.12)
  Bottom Layer w0.254: v1(49.78,121.12) 49.78,120.36 50.42,119.72 v1(50.93,119.72)
HEADPHONE_RIGHT: length 14.1
  Top Layer w0.254: CODEC.1 52.83,121.24 51.38,122.69 51.38,126.71 51.76,127.1 51.76,127.58 54.6,127.58 HEADPHONE.2
I2C_SCL: length 94.2
  Top Layer w0.2: R5.2 52.82,123.14 52.82,122.65 52.96,122.51 54.23,122.51 54.48,122.26 CODEC.19
  Top Layer w0.254: v1(199.01,112.1) ESP32S3.25
  Bottom Layer w0.254: v1(199.01,112.1) 198.97,112.06 198.45,112.06 198.37,111.98 198.37,111.91 197.98,111.52 197.5,111.52 197.16,111.86 197.16,112.34 197.46,112.65 197.46,121.72 194.25,124.93 183.45,124.93 183.38,125 182.89,125 182.82,124.93 170.41,124.93 170.41,106.49 170.2,106.28 144.8,106.28 OLED.3
I2C_SDA: length 188.7
  Top Layer w0.2: CODEC.18 54.91,121.88 54.91,122.39 55.51,123 56.03,123 56.13,123.1 R6.2
  Top Layer w0.254: OLED.4 138.81,119.34 138.56,119.59 81.91,119.59 78.33,123.18 71.41,123.18 69.75,124.83 66.4,124.83 66.29,124.94 66.29,127.59 ; ESP32S3.24 v1(197.74,112.1)
  Bottom Layer w0.254: OLED.4 138.97,102.99 138.97,121.75 139.22,122.01 166.79,122.01 170.22,125.44 194.56,125.44 197.88,122.12 197.88,112.25 v1(197.74,112.1)
I2S_BCLK: length 154.5
  Top Layer w0.2: CODEC.15 56.29,121.25 56.91,121.25 v1(57.65,121.98)
  Top Layer w0.254: v1(199.34,119.53) 199.4,119.47 ESP32S3.33
  Bottom Layer w0.254: v1(57.65,121.98) 58.14,121.98 61.97,125.81 126.55,125.81 129.34,123.02 156.2,123.02 159.47,126.3 195.23,126.3 198.78,122.75 198.78,122.06 199.03,121.81 199.03,119.84 v1(199.34,119.53)
I2S_DIN: length 154.5
  Top Layer w0.2: CODEC.17 55.32,121.9 55.32,122.28 55.67,122.63 56.67,122.63 56.82,122.78 56.82,123.39 57.6,124.17 v1(57.66,124.17)
  Top Layer w0.254: ESP32S3.35 202.03,122.03 v1(200.17,122.03)
  Bottom Layer w0.254: v1(200.17,122.03) 200.17,122.88 195.86,127.19 159.8,127.19 157.08,129.92 128.44,129.92 125.25,126.72 60.44,126.72 57.88,124.17 v1(57.66,124.17)
I2S_DOUT: length 154.2
  Top Layer w0.254: 55.72,121.85 56.69,121.85 v1(57.66,122.82) ; v1(199.92,120.74) 202.04,120.74 ESP32S3.34
  Bottom Layer w0.254: v1(199.92,120.74) 199.59,121.07 199.59,122.57 195.45,126.71 195.42,126.71 195.4,126.72 159.42,126.72 156.77,129.37 128.75,129.37 125.67,126.3 60.62,126.3 57.66,123.34 v1(57.66,122.82)
I2S_MLCK: length 166
  Top Layer w0.254: v1(200.79,116.93) 202.04,116.93 ESP32S3.31 ; R7.1 53.86,124.04 52.2,124.04 51.94,124.29 51.94,125.94 52.7,126.7 59.18,126.7 v1(59.31,126.83)
  Bottom Layer w0.254: v1(200.79,116.93) 200.79,123.15 196.22,127.72 160.15,127.72 157.35,130.52 128.22,130.52 124.92,127.21 59.69,127.21 v1(59.31,126.83)
I2S_WS: length 155.6
  Top Layer w0.2: v1(57.85,121.17) 57.55,120.88 57.54,120.88 57.51,120.84 CODEC.14
  Top Layer w0.254: v1(198.75,118.2) 202.04,118.2 ESP32S3.32
  Bottom Layer w0.254: v1(198.75,118.2) 198.53,118.43 198.53,121.71 198.35,121.88 198.35,122.41 194.89,125.87 159.87,125.87 156.51,122.52 128.94,122.52 126.07,125.39 62.14,125.39 58.31,121.56 58.23,121.56 v1(57.85,121.17)
LED_CTRL: length 291
  Top Layer w0.254: v1(9.02,64.48) 10.28,64.48 U2.2 ; v1(9.02,59.27) 9.52,59.78 194.69,59.78 195.07,60.16 195.07,71.46 195.45,71.84 209.5,71.84 209.96,72.3 209.96,84.74 209.78,84.92 207.64,84.92 207.45,85.12 207.45,85.14 203.96,88.63 203.96,95.26 202.89,96.33 195.88,96.33 193.91,98.3 184.62,98.3 184.01,98.91 184.01,102.98 184.05,102.98 184.66,103.59 195.83,103.59 196.47,104.22 ESP32S3.23
  Bottom Layer w0.254: v1(9.02,59.27) v1(9.02,64.48)
LINE_IN_LEFT: length 5.4
  Top Layer w0.254: LINE-IN.5 21.67,124.76 C25.1
LINE_IN_RIGHT: length 5.3
  Top Layer w0.254: 31.64,130.05 31.64,124.73 C26.1
